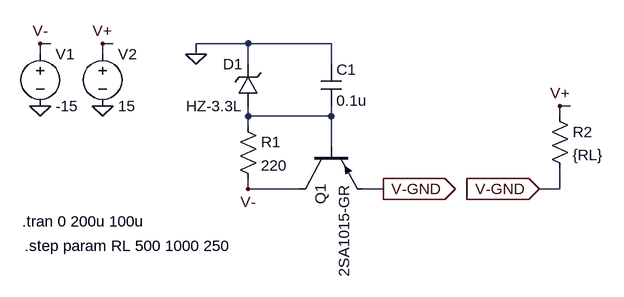
[diagram p0: schematic Zener-Constant-V.asc]
Zener-Constant-V.asc, the LTspice schematic file:
Version 4
SHEET 1 880 680
WIRE -400 -160 -416 -160
WIRE -304 -160 -320 -160
WIRE -96 -160 -176 -160
WIRE 32 -160 -96 -160
WIRE -416 -144 -416 -160
WIRE -320 -144 -320 -160
WIRE -176 -144 -176 -160
WIRE -96 -128 -96 -160
WIRE 32 -128 32 -160
WIRE 400 -64 384 -64
WIRE -96 -48 -96 -64
WIRE 32 -48 32 -64
WIRE 32 -48 -96 -48
WIRE 384 -48 384 -64
WIRE -96 -32 -96 -48
WIRE 32 0 32 -48
WIRE -96 64 -96 48
WIRE -16 64 -96 64
WIRE 112 64 80 64
WIRE 384 64 384 32
WIRE 384 64 352 64
FLAG -416 -64 0
FLAG -320 -64 0
FLAG -416 -160 V-
FLAG -320 -160 V+
FLAG -176 -144 0
FLAG -96 64 V-
FLAG 112 64 V-GND
IOPIN 112 64 Out
FLAG 352 64 V-GND
IOPIN 352 64 In
FLAG 384 -64 V+
SYMBOL zener -80 -64 R180
WINDOW 0 24 64 Left 2
WINDOW 3 24 0 Left 2
SYMATTR InstName D1
SYMATTR Value HZ-3.3L
SYMBOL voltage -416 -160 R0
WINDOW 123 0 0 Left 2
WINDOW 39 0 0 Left 2
SYMATTR InstName V1
SYMATTR Value -15
SYMBOL voltage -320 -160 R0
WINDOW 123 0 0 Left 2
WINDOW 39 0 0 Left 2
SYMATTR InstName V2
SYMATTR Value 15
SYMBOL res -112 -48 R0
SYMATTR InstName R1
SYMATTR Value 220
SYMBOL pnp -16 0 M90
SYMATTR InstName Q1
SYMATTR Value 2SA1015-GR
SYMBOL cap 16 -128 R0
SYMATTR InstName C1
SYMATTR Value 0.1u
SYMBOL res 368 -64 R0
SYMATTR InstName R2
SYMATTR Value {RL}
TEXT -444 114 Left 2 !.tran 0 200u 100u
TEXT -440 152 Left 2 !.step param RL 500 1000 250

The netlist it stands for:
* Zener-Constant-V.asc
D1 N001 0 HZ-3.3L
V1 V- 0 -15
V2 V+ 0 15
R1 N001 V- 220
Q1 V- N001 V-GND 0 2SA1015-GR
C1 0 N001 0.1u
R2 V+ V-GND {RL}
.model D D
.lib standard.dio
.model NPN NPN
.model PNP PNP
.lib standard.bjt
.tran 0 200u 100u
.step param RL 500 1000 250
.backanno
.end